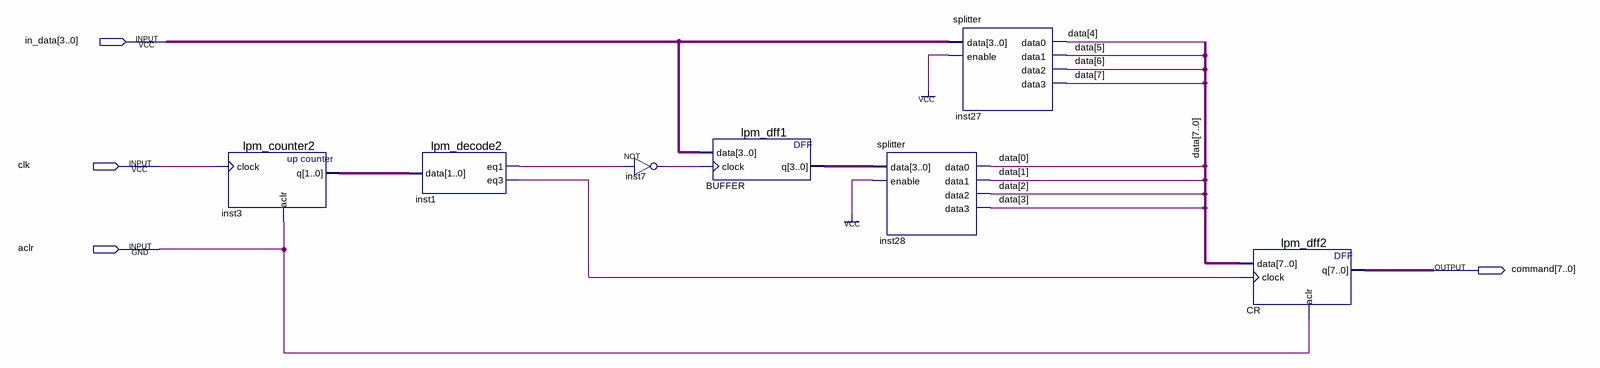
[diagram p0: schematic sheet]
// Quartus schematic command_reg.bdf as structural Verilog: 7 symbols, 4 pins
module command_reg (
  input  [3:0] in_data,
  input  clk,
  input  aclr,
  output [7:0] command
);

  wire inst1_eq1, inst1_eq3, inst7_out;
  wire [1:0] inst3_q;
  wire [3:0] BUFFER_q;
  wire [7:0] data;

  lpm_counter2 inst3 (.clock(clk), .aclr(aclr), .q(inst3_q));
  lpm_decode2 inst1 (.data(inst3_q), .eq1(inst1_eq1), .eq3(inst1_eq3));
  not inst7 (inst7_out, inst1_eq1);
  lpm_dff1 BUFFER (.data(in_data), .clock(inst7_out), .q(BUFFER_q));
  splitter inst28 (.data(BUFFER_q), .enable(1'b1), .data0(data[0]), .data1(data[1]), .data2(data[2]), .data3(data[3]));
  splitter inst27 (.data(in_data), .enable(1'b1), .data0(data[4]), .data1(data[5]), .data2(data[6]), .data3(data[7]));
  lpm_dff2 CR (.data(data), .clock(inst1_eq3), .aclr(aclr), .q(command));
endmodule
